# EAGLE design LickDetector Flex (EAGLE 9.4.2)
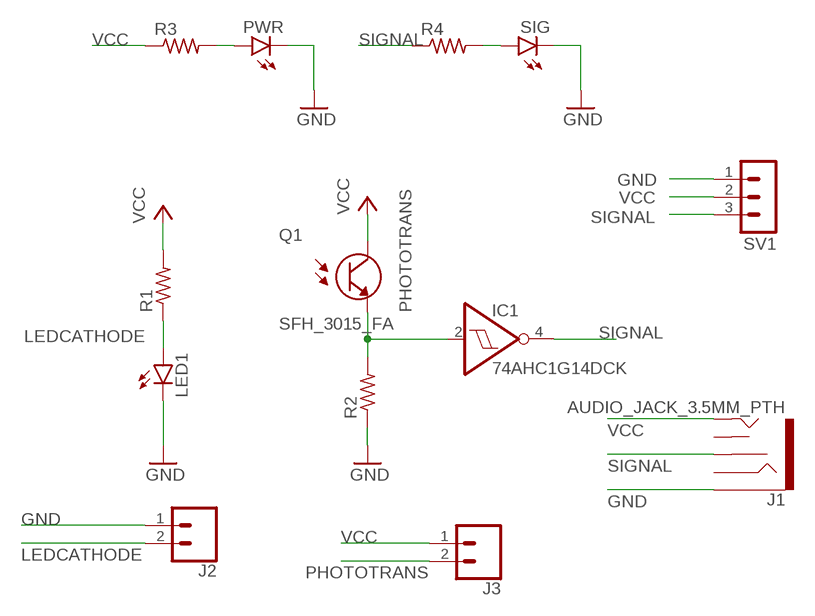
[diagram p0: schematic, sheet 1]

## Parts
IC1  74AHC1G14DCK  [SC70-5]
J1  AUDIO_JACK_3.5MM_PTH  [AUDIO-JACK]
J2  CONN_02  [1X02]
J3  CONN_02  [1X02]
LED1  LEDCHIPLED_1206  [CHIPLED_1206]
PWR  LEDCHIP-LED0603  [CHIP-LED0603]
Q1  SFH_3015_FA  [XDCR_SFH_3015_FA]
R1  R-US_R0603  [R0603]
R2  R-US_R0603  [R0603]
R3  R-US_R0603  [R0603]
R4  R-US_R0603  [R0603]
SIG  LEDCHIP-LED0603  [CHIP-LED0603]
SV1  MA03-1  [MA03-1]

## Nets
GND: J1.SLEEVE J2.1 LED1.C PWR.C R2.1 SIG.C SV1.1
LEDCATHODE: J2.2 LED1.A R1.1
N$1: PWR.A R3.2
N$2: R4.2 SIG.A
PHOTOTRANS: IC1.2(I) J3.2 Q1.1(E) R2.2
SIGNAL: IC1.4(O) J1.RSH R4.1 SV1.3
VCC: J1.TIP J3.1 Q1.2(C) R1.2 R3.1 SV1.2
Unconnected: J1.RING J1.TSH

## Power pins joined to a net without a drawn wire
GND: IC1.3(GND)
VCC: IC1.5(VCC)

## Library data of the parts
IC1 = 74xx-little-de:74*1G14: Single Schmitt-Trigger Inverter Gate
J1 = SparkFun-Connectors:AUDIO_JACK_3.5MM: Audio Jack 3.5mm variants of PTH and SMT stereo audio jack with bypass switches. SparkFun Products: SparkFun SparkPunk Sound Kit <[https://www.sparkfun.com/products/11177]> - PTH MP3 Trigger <https://www.sparkfun.com/products/13720> -3.5mm SMD SparkFun PicoBoard <https://www.sparkfun.com/products/11888>- 2.5mm SMD; PROD_ID: CONN-08774; SF_ID: PRT-08032
J2 J3 = SparkFun-Connectors:CONN_02: Multi connection point. Often used as Generic Header-pin footprint for 0.1 inch spaced/style header connections On any of the 0.1 inch spaced packages, you can populate with these: Break Away Headers - Straight <https://www.sparkfun.com/products/116> (PRT-00116) Break Away Male Headers - Right Angle <https://www.sparkfun.com/products/553> (PRT-00553) Female Headers <https://www.sparkfun.com/products/115> (PRT-00115) Break Away Headers - Machine Pin <https://www.sparkfun.com/products/117> (PRT-00117) Break Away Female Headers - Swiss Machine Pin <https://www.sparkfun.com/products/743> (PRT-00743) For SCREWTERMINALS and SPRING TERMINALS visit here: Screw Terimnals on SparkFun.com <https://www.sparkfun.com/search/results?term=Screw+Terminals> (5mm/3.5mm/2.54mm spacing) This device is also useful as a general connection point to wire up your design to another part of your project. Our various solder wires solder well into these plated through hole pads. Hook-Up Wire - Assortment (Stranded, 22 AWG) <https://www.sparkfun.com/products/11375> (PRT-11375) Hook-Up Wire - Assortment (Solid Core, 22 AWG) <https://www.sparkfun.com/products/11367> (PRT-11367) View the entire wire category on our website here <https://www.sparkfun.com/categories/141> Special notes: Molex polarized connector foot print use with: PRT-08233 with associated crimp pins and housings. 2.54_SCREWTERM for use with PRT-10571. 3.5mm Screw Terminal footprints for PRT-08084 5mm Screw Terminal footprints for use with PRT-08432
LED1 PWR SIG = led:LED: LED OSRAM: - CHIPLED LG R971, LG N971, LY N971, LG Q971, LY Q971, LO R971, LY R971 LH N974, LH R974 LS Q976, LO Q976, LY Q976 LO Q996 - Hyper CHIPLED LW Q18S LB Q993, LB Q99A, LB R99A - SideLED LS A670, LO A670, LY A670, LG A670, LP A670 LB A673, LV A673, LT A673, LW A673 LH A674 LY A675 LS A676, LA A676, LO A676, LY A676, LW A676 LS A679, LY A679, LG A679 - Hyper Micro SIDELED® LS Y876, LA Y876, LO Y876, LY Y876 LT Y87S - SmartLED LW L88C, LW L88S LB L89C, LB L89S, LG L890 LS L89K, LO L89K, LY L89K LS L896, LA L896, LO L896, LY L896 - TOPLED LS T670, LO T670, LY T670, LG T670, LP T670 LSG T670, LSP T670, LSY T670, LOP T670, LYG T670 LG T671, LOG T671, LSG T671 LB T673, LV T673, LT T673, LW T673 LH T674 LS T676, LA T676, LO T676, LY T676, LB T676, LH T676, LSB T676, LW T676 LB T67C, LV T67C, LT T67C, LS T67K, LO T67K, LY T67K, LW E67C LS E67B, LA E67B, LO E67B, LY E67B, LB E67C, LV E67C, LT E67C LW T67C LS T679, LY T679, LG T679 LS T770, LO T770, LY T770, LG T770, LP T770 LB T773, LV T773, LT T773, LW T773 LH T774 LS E675, LA E675, LY E675, LS T675 LS T776, LA T776, LO T776, LY T776, LB T776 LHGB T686 LT T68C, LB T68C - Hyper Mini TOPLED® LB M676 - Mini TOPLED Santana® LG M470 LS M47K, LO M47K, LY M47K Source: http://www.osram.convergy.de LUXEON: - LUMILED® LXK2-PW12-R00, LXK2-PW12-S00, LXK2-PW14-U00, LXK2-PW14-V00 LXK2-PM12-R00, LXK2-PM12-S00, LXK2-PM14-U00 LXK2-PE12-Q00, LXK2-PE12-R00, LXK2-PE12-S00, LXK2-PE14-T00, LXK2-PE14-U00 LXK2-PB12-K00, LXK2-PB12-L00, LXK2-PB12-M00, LXK2-PB14-N00, LXK2-PB14-P00, LXK2-PB14-Q00 LXK2-PR12-L00, LXK2-PR12-M00, LXK2-PR14-Q00, LXK2-PR14-R00 LXK2-PD12-Q00, LXK2-PD12-R00, LXK2-PD12-S00 LXK2-PH12-R00, LXK2-PH12-S00 LXK2-PL12-P00, LXK2-PL12-Q00, LXK2-PL12-R00 Source: www.luxeon.com KINGBRIGHT: KA-3528ASYC Source: www.kingbright.com
Q1 = SFH_3015_FA:SFH_3015_FA: Phototransistor Chip NPN Transistor 870nm 2-Pin SMD T/R; DESCRIPTION: Phototransistor Chip NPN Transistor 870nm 2-Pin SMD T/R; DIGI-KEY_PART_NUMBER: 475-2914-1-ND; DIGI-KEY_PURCHASE_URL: https://www.digikey.com/product-detail/en/osram-opto-semiconductors-inc/SFH-3015-FA/475-2914-1-ND/2415041?utm_source=snapeda&utm_medium=aggregator&utm_campaign=symbol; MF: OSRAM Opto; MP: SFH 3015 FA; PACKAGE: 1206 Osram Opto
R1-R4 = resistor:R-US_: RESISTOR, American symbol
SV1 = con-lstb:MA03-1: PIN HEADER; OC_FARNELL: unknown; OC_NEWARK: unknown

## Board
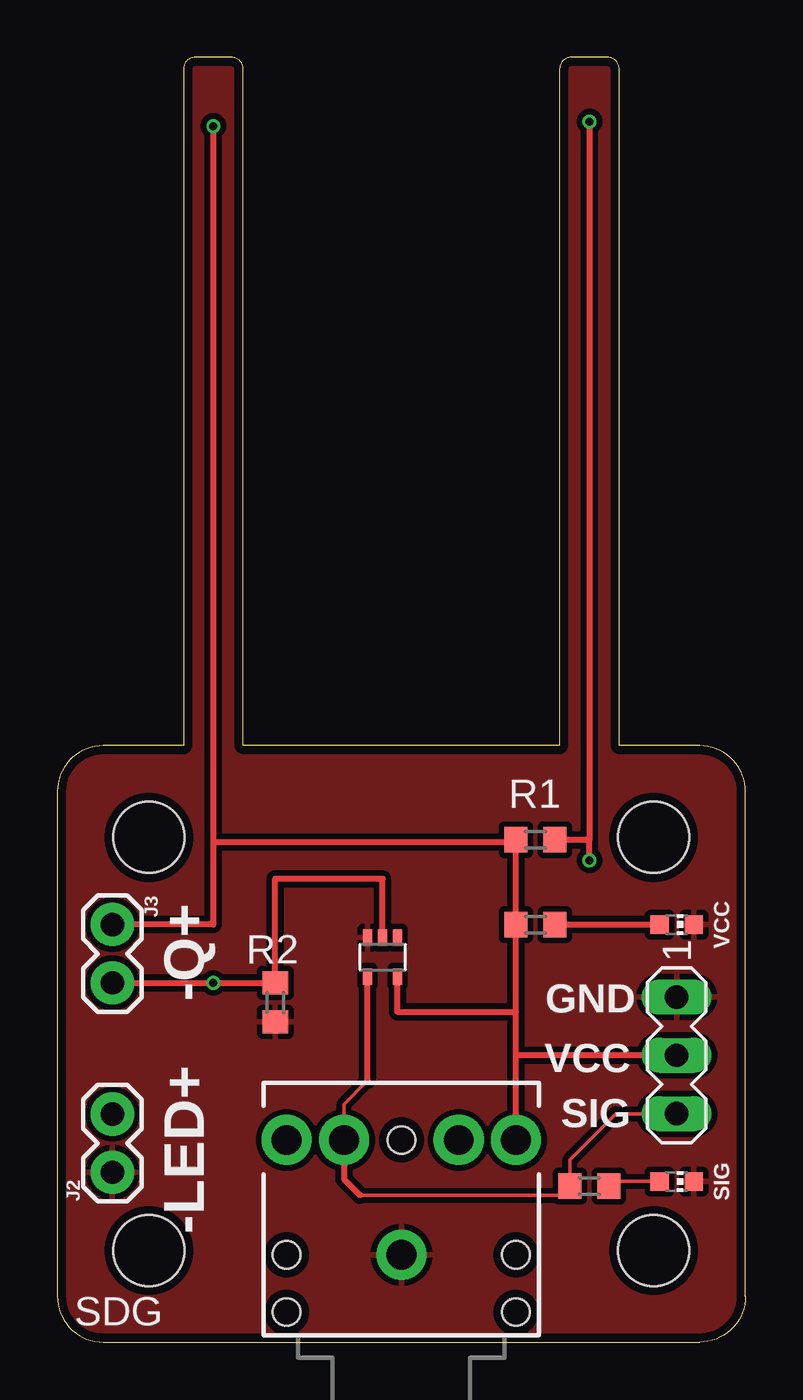
[diagram p1: board, top side]
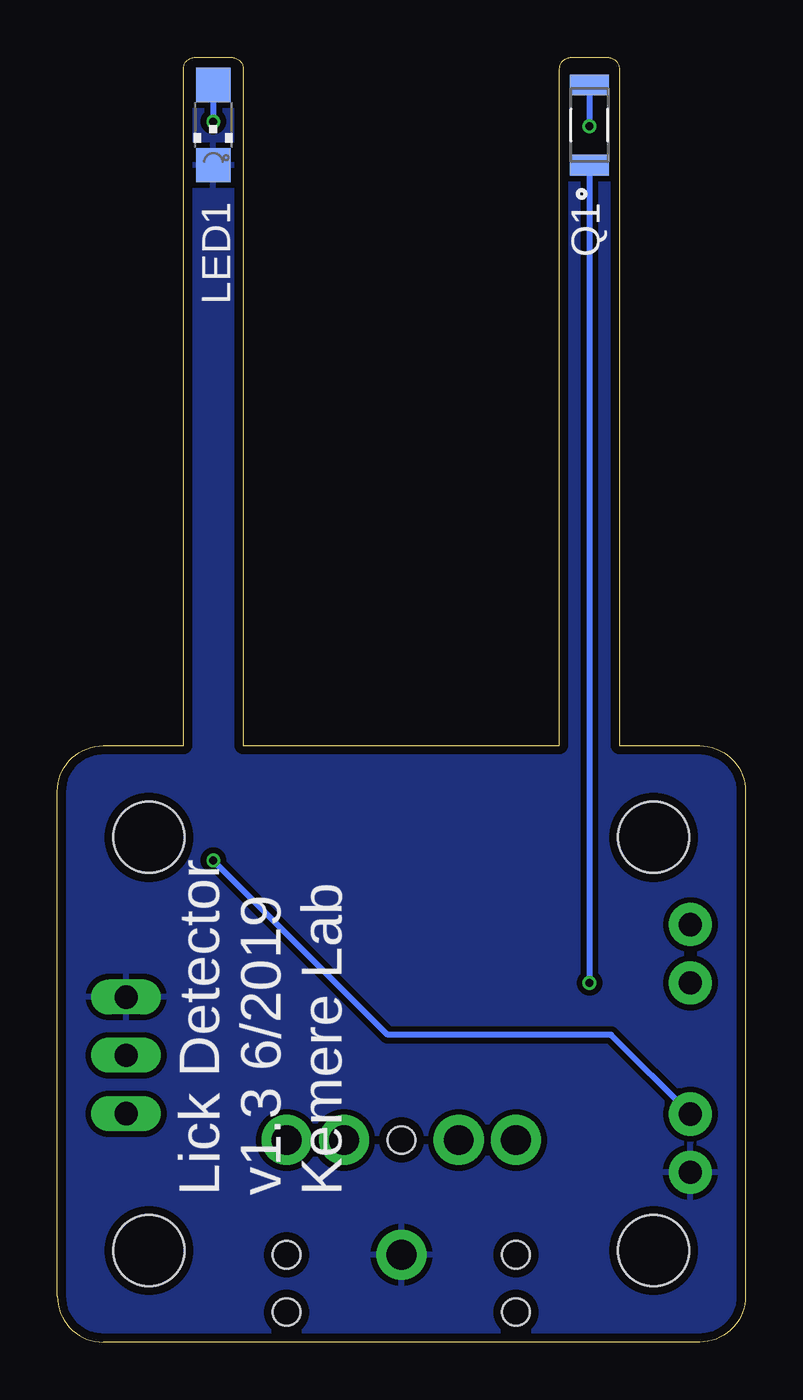
[diagram p2: board, bottom side, seen from below]

Size 30 x 56 mm. Coordinates in mm from the lower left corner, seen from the top.
Outline: 30,2 30,24 arc90 28,26 24.5,26 24.5,55.5 arc90 24,56 22.4,56 arc90 21.9,55.5 21.9,26 8.1,26 8.1,55.5 arc90 7.6,56 6,56 arc90 5.5,55.5 5.5,26 2,26 arc90 0,24 0,2 arc90 2,0 28,0 arc90 30,2
Copper layers (1*16): Top 0.035559375mm / dielectric 1.6mm / Bottom 0.035559375mm
Design rules "oshpark-2layer": minimum track width 6mil, minimum drill 10mil, track to track 6mil, track to pad 6mil, pad to pad 6mil, via to via 6mil, smd to smd 6mil, copper to edge 15mil, drill to drill 6mil, minimum pad ring 5mil, minimum via ring 5mil, stop-mask expansion 2.5mil, vias tented up to drill 0mil, thermal gap 10mil
Holes 3.1 mm at 4,22 26,22 4,4 26,4

### Footprints (pad centres in the part's own frame; a part is rotated, then mirrored left to right if it is on the bottom)
SC70-5 = smd 0.4 x 0.7: 1 -0.65,-0.85; 2 0,-0.85; 3 0.65,-0.85; 4 0.65,0.85; 5 -0.65,0.85
AUDIO-JACK = drill 1.3 pad 2.184: RING 5,5; RSH 5,2.5; SLEEVE 0,0; TIP 5,-5; TSH 5,-2.5 | hole 1.2: 0,5; -2.5,5; -2.5,-5; 0,-5; 5,0
1X02 = drill 1.016 pad 1.88: 1 0,0; 2 2.54,0
CHIPLED_1206 = smd 1.5 x 1.5: A 0,-1.75; C 0,1.75
CHIP-LED0603 = smd 0.8 x 0.8: A 0,-0.75; C 0,0.75
XDCR_SFH_3015_FA = smd 0.9 x 1.7: 1 -1.75,0; 2 1.75,0
R0603 = smd 1 x 1.1: 1 -0.85,0; 2 0.85,0
MA03-1 = drill 1.016 long: 1 -2.54,0; 2 0,0; 3 2.54,0

### Placement (x,y rotation side)
IC1  14.18,16.78 180 top
J1  15,3.81 90 top
J2  2.4,7.4 90 top
J3  2.4,18.2 270 top
LED1  23.2,53.05 180 bottom
PWR  27,18.2 270 top
Q1  6.8,53.05 90 bottom
R1  20.85,21.9 180 top
R2  9.5,14.81 90 top
R3  20.85,18.2 0 top
R4  23.2,6.8 0 top
SIG  27,7 270 top
SV1  27,12.5 270 top

### Tracks (layer width: path | path; a pad name or v marks a point on that pad's centre or on a via)
GND
  pour Top (isolate 0.25): 30,0 30,55.8 0,55.8 0,0
  pour Bottom (isolate 0.25): 0,0 30,0 30,55.8 0,55.8
LEDCATHODE  (via drill 0.35)
  Top 0.254: 23.2,21.9 R1.1 | v23.2,53.2 23.2,21.9 | v23.2,21 23.2,21.9
  Bottom 0.254: LED1.A v23.2,53.2 | J2.2 5.86,13.4 15.6,13.4 v23.2,21
N$1
  Top 0.254: R3.2 PWR.A
N$2
  Top 0.152: R4.2 24.25,7 SIG.A
PHOTOTRANS  (via drill 0.35)
  Top 0.254: IC1.2 14.18,20.2 9.5,20.2 R2.2 v6.8,15.66 J3.2
  Bottom 0.254: Q1.1 v6.8,15.66
SIGNAL
  Top 0.152: 13.2,6.4 21.95,6.4 R4.1 22.35,7.95 24.36,9.96 SV1.3 | J1.RSH 12.5,10.37 13.53,11.4
  Top 0.254: 13.2,6.4 12.5,7.1 J1.RSH 12.5,9.41 | 13.53,11.4 IC1.4
VCC  (via drill 0.35)
  Top 0.254: IC1.5 14.83,14.4 20,14.4 | v6.8,53.01 6.8,21.8 | 6.8,21.8 6.8,18.2 J3.1 | 6.8,21.8 19.65,21.8 R1.2 R3.1 20,14.4 | J1.TIP 20,12.5 | 20,12.5 20,14.4 | SV1.2 20,12.5
  Bottom 0.254: Q1.2 v6.8,53.01

### Text on the board
tNames: VCC | -Q+ | GND | VCC | SIG | -LED+ | SIG | SDG
bNames: Lick Detector / v1.3 6/2019 / Kemere Lab